# EAGLE design mw_am_lpf (EAGLE 9.0.0)
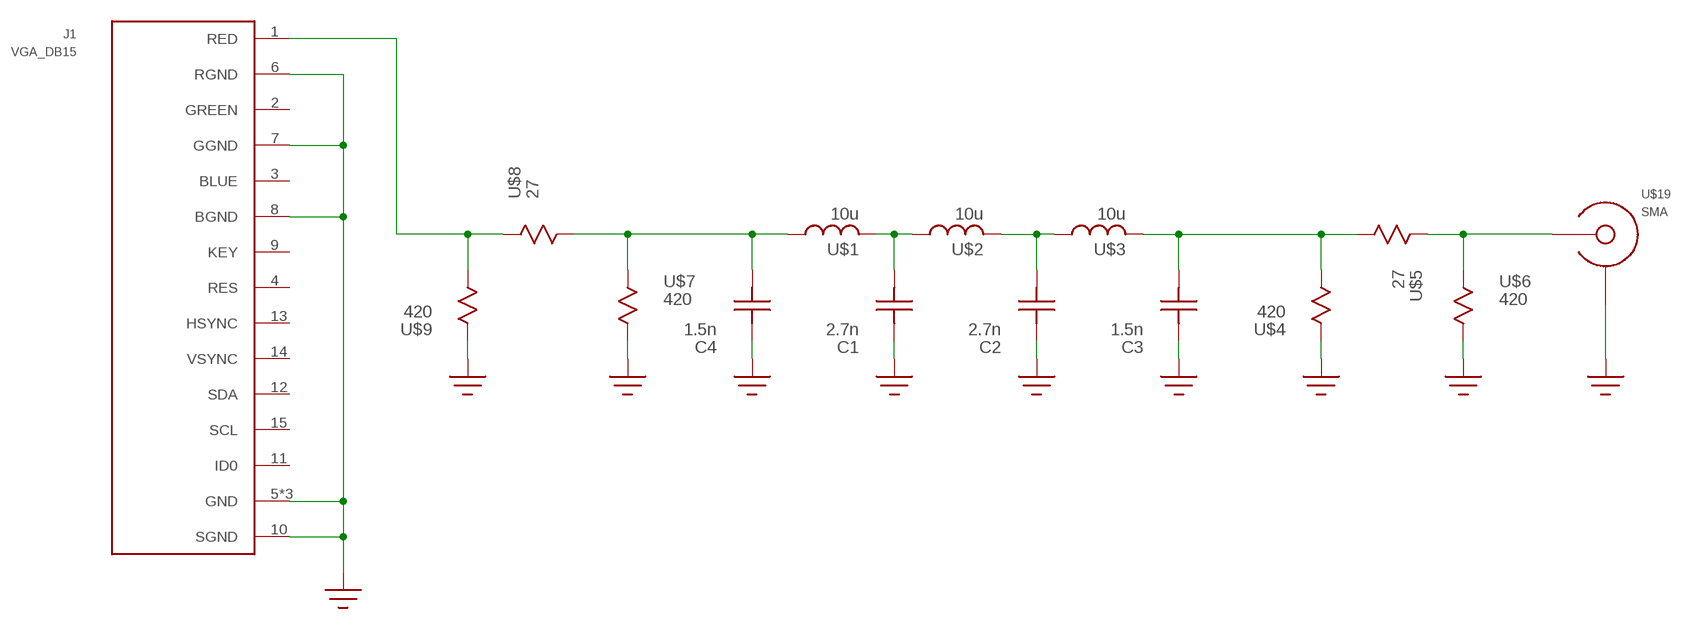
[diagram p0: schematic, sheet 1]

## Parts
C1  2.7n  C0805  [0805]
C2  2.7n  C0805  [0805]
C3  1.5n  C0805  [0805]
C4  1.5n  C0805  [0805]
J1  VGA_DB15  [VGA_PCB_MALE]
U$1  10u  INDUCTORL0.4X0.6  [L0.4X0.6]
U$2  10u  INDUCTOR  [L_VERTICAL]
U$3  10u  INDUCTORL0.4X0.6  [L0.4X0.6]
U$4  420  R0805  [R0805]
U$5  27  R0805  [R0805]
U$6  420  R0805  [R0805]
U$7  420  R0805  [R0805]
U$8  27  R0805  [R0805]
U$9  420  R0805  [R0805]
U$19  SMA  EDGE_LAUNCH_JACK  [EDGE_LAUNCH_RF_CON]

## Nets
GND: C1.P$2 C2.P$2 C3.P$2 C4.P$2 J1.5(GND) J1.6(RGND) J1.7(GGND) J1.8(BGND) J1.10(SGND) J1.TAB@1(GND) J1.TAB@2(GND) U$4.P$1 U$6.P$2 U$7.P$2 U$9.P$1 U$19.GND@1(SHIELD) U$19.GND@2(SHIELD) U$19.GND@3(SHIELD) U$19.GND@4(SHIELD) U$19.GND@5(SHIELD) U$19.GND@6(SHIELD) U$19.GND@7(SHIELD) U$19.GND@8(SHIELD) U$19.GND@9(SHIELD) U$19.GND@10(SHIELD) U$19.GND@11(SHIELD) U$19.GND@12(SHIELD) U$19.SHIELD@1(SHIELD) U$19.SHIELD@2(SHIELD)
N$1: C2.P$1 U$2.P$2 U$3.P$1
N$2: C1.P$1 U$1.P$2 U$2.P$1
N$3: C3.P$1 U$3.P$2 U$4.P$2 U$5.P$2
N$4: C4.P$1 U$1.P$1 U$7.P$1 U$8.P$2
N$5: U$5.P$1 U$6.P$1 U$19.CENTER
N$6: J1.1(RED) U$8.P$1 U$9.P$2
Unconnected: J1.2(GREEN) J1.3(BLUE) J1.4(RES) J1.9(KEY) J1.11(ID0) J1.12(SDA) J1.13(HSYNC) J1.14(VSYNC) J1.15(SCL)

## Library data of the parts
C1-C4 = mw-voice-marker:C
J1 = mw-voice-marker:VGA_DB15
U$1-U$3 = mw-voice-marker:INDUCTOR
U$4-U$9 = mw-voice-marker:R
U$19 = mw-voice-marker:EDGE_LAUNCH_JACK

## Board
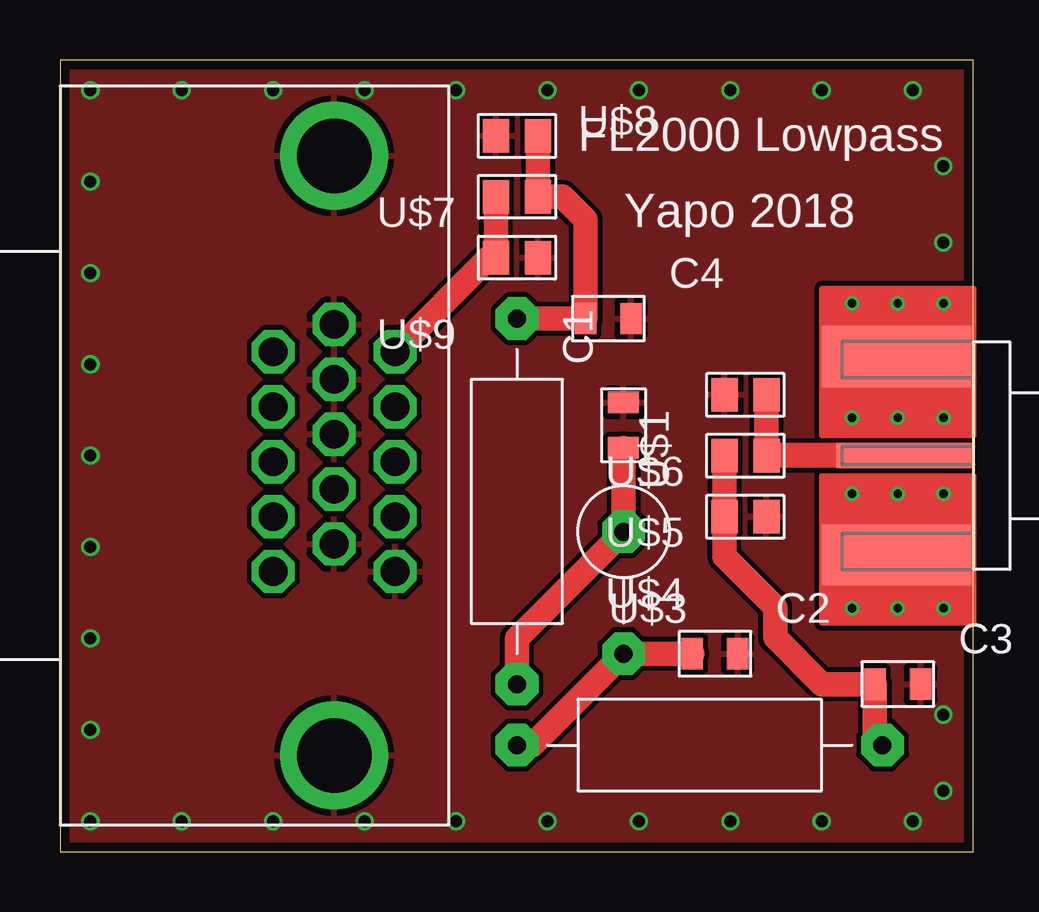
[diagram p1: board, top side]
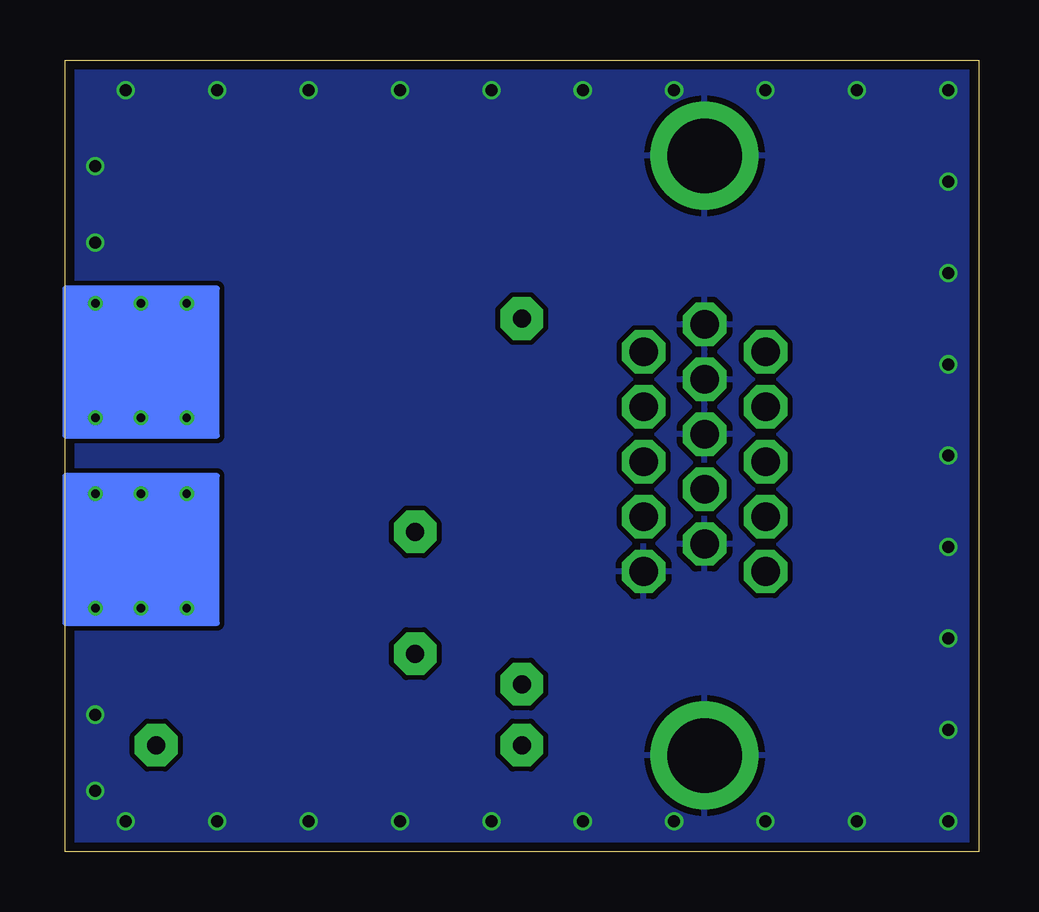
[diagram p2: board, bottom side, seen from below]

Size 38.08 x 33.01 mm. Coordinates in mm from the lower left corner, seen from the top.
Outline: 0,0 38.08,0 38.08,33.01 0,33.01 0,0
Copper layers (1*16): Top 0.035559375mm / dielectric 1.6mm / Bottom 0.035559375mm
Design rules "oshpark-2layer *": minimum track width 6mil, minimum drill 10mil, track to track 8mil, track to pad 8mil, pad to pad 8mil, via to via 8mil, smd to smd 6mil, copper to edge 15mil, drill to drill 6mil, minimum pad ring 5mil, minimum via ring 5mil, stop-mask expansion 2.5mil, vias tented up to drill 0mil, thermal gap 10mil

### Footprints (pad centres in the part's own frame; a part is rotated, then mirrored left to right if it is on the bottom)
0805 = smd 0.9 x 1.3: P$1 -0.95,0; P$2 0.95,0
VGA_PCB_MALE = drill 1.2 octagon: 1 -4.33,2.54; 2 -2.04,2.54; 3 0.25,2.54; 4 2.54,2.54; 5 4.83,2.54; 6 -5.475,0; 7 -3.185,0; 8 -0.895,0; 9 1.395,0; 10 3.685,0; 11 -4.33,-2.54; 12 -2.04,-2.54; 13 0.25,-2.54; 14 2.54,-2.54; 15 4.83,-2.54 | drill 3.1 pad 4.5: TAB@1 -12.5,0; TAB@2 12.5,0
L0.4X0.6 = drill 0.75 pad 1.778 octagon: P$1 -7.62,0; P$2 7.62,0
L_VERTICAL = drill 0.75 pad 1.778 octagon: P$1 0,0; P$2 5.08,0
R0805 = smd 1.1 x 1.4: P$1 -0.875,0; P$2 0.875,0
EDGE_LAUNCH_RF_CON = smd 5.715 x 1.041: CENTER -2.875,0 | drill 0.35: GND@1 -5.08,1.587; GND@2 -3.175,1.587; GND@3 -1.27,1.587; GND@4 -5.08,-1.587; GND@5 -3.175,-1.587; GND@6 -1.27,-1.587; GND@7 -5.08,6.35; GND@8 -3.175,6.35; GND@9 -1.27,6.35; GND@10 -5.08,-6.35; GND@11 -3.175,-6.35; GND@12 -1.27,-6.35 | smd 6.35 x 2.54: SHIELD@1 -3.175,-4.128; SHIELD@2 -3.175,4.128

### Placement (x,y rotation side)
C1  23.5,17.78 90 top
C2  27.3,8.26 0 top
C3  34.92,6.99 0 top
C4  22.86,22.23 0 top
J1  11.43,16.51 270 top
U$1  19.05,14.61 270 top
U$2  23.5,13.34 270 top
U$3  26.67,4.45 0 top
U$4  28.57,13.97 180 top
U$5  28.57,16.51 180 top
U$6  28.57,19.05 180 top
U$7  19.05,29.84 180 top
U$8  19.05,27.3 0 top
U$9  19.05,24.77 180 top
U$19  38.1,16.51 0 top

### Tracks (layer width: path | path; a pad name or v marks a point on that pad's centre or on a via)
GND  (via drill 0.5)
  other vias: 1.27,1.27 5.08,1.27 8.89,1.27 12.7,1.27 16.51,1.27 20.32,1.27 24.13,1.27 27.94,1.27 31.75,1.27 35.56,1.27 1.27,5.08 1.27,8.89 1.27,12.7 1.27,16.51 1.27,20.32 1.27,24.13 1.27,27.94 1.27,31.75 5.08,31.75 8.89,31.75 12.7,31.75 16.51,31.75 20.32,31.75 24.13,31.75 27.94,31.75 31.75,31.75 35.56,31.75 36.83,28.57 36.83,25.4 36.83,2.54 36.83,5.71
  pour Top: 0,0 38.1,0 38.1,33.02 0,33.02
  pour Bottom: 0,0 38.1,0 38.1,33.02 0,33.02
N$1
  Top 1.016: U$3.P$1 19.68,4.45 U$2.P$2 C2.P$1
N$2
  Top 1.016: U$1.P$2 19.05,8.89 U$2.P$1 C1.P$1
N$3
  Top 1.016: U$5.P$2 U$4.P$2 27.7,12.3 29.82,10.19 29.82,8.93 31.77,6.99 C3.P$1 33.98,4.76 U$3.P$2
N$4
  Top 1.016: U$7.P$1 U$8.P$2 20.95,27.3 21.91,26.35 C4.P$1 U$1.P$1
N$5
  Top 1.016: U$6.P$1 U$5.P$1
  Top 1.041: U$19.CENTER U$5.P$1
N$6
  Top 1.016: J1.1 17.89,24.77 U$9.P$2 U$8.P$1

### Text on the board
tPlace: FL2000 Lowpass | Yapo 2018